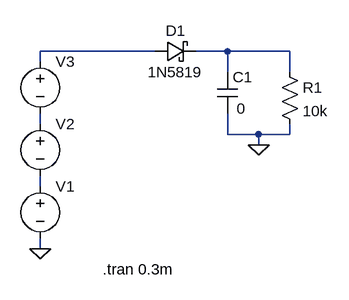
[diagram p0: schematic Detector_1N5819.asc]
Detector_1N5819.asc, the LTspice schematic file:
Version 4
SHEET 1 880 680
WIRE 192 32 16 32
WIRE 304 32 256 32
WIRE 400 32 304 32
WIRE 16 48 16 32
WIRE 304 64 304 32
WIRE 400 64 400 32
WIRE 16 144 16 128
WIRE 304 160 304 128
WIRE 352 160 304 160
WIRE 400 160 400 144
WIRE 400 160 352 160
WIRE 352 176 352 160
WIRE 16 240 16 224
WIRE 16 336 16 320
FLAG 352 176 0
FLAG 16 336 0
SYMBOL schottky 192 48 R270
WINDOW 0 32 32 VTop 2
WINDOW 3 0 32 VBottom 2
SYMATTR InstName D1
SYMATTR Value 1N5819
SYMATTR Description Diode
SYMATTR Type diode
SYMBOL res 384 48 R0
SYMATTR InstName R1
SYMATTR Value 10k
SYMBOL voltage 16 224 R0
WINDOW 3 24 96 Invisible 2
WINDOW 123 0 0 Left 0
SYMATTR Value SINE(0 10 750k 0 0 0 0)
SYMATTR InstName V1
SYMATTR SpiceLine Rser=0
SYMBOL voltage 16 128 R0
WINDOW 3 24 96 Invisible 2
WINDOW 123 0 0 Left 0
SYMATTR Value SINE(0 2.5 740k 0 0 0 0)
SYMATTR InstName V2
SYMATTR SpiceLine Rser=0
SYMBOL voltage 16 32 R0
WINDOW 3 24 96 Invisible 2
WINDOW 123 0 0 Left 0
SYMATTR Value SINE(0 2.5 760k 0 0 0 0)
SYMATTR InstName V3
SYMATTR SpiceLine Rser=0
SYMBOL cap 288 64 R0
WINDOW 3 30 56 Left 2
SYMATTR Value 0
SYMATTR InstName C1
TEXT 112 368 Left 2 !.tran 0.3m

The netlist it stands for:
* Detector_1N5819.asc
D1 N001 N002 1N5819
R1 N002 0 10k
V1 N004 0 SINE(0 10 750k 0 0 0 0) Rser=0
V2 N003 N004 SINE(0 2.5 740k 0 0 0 0) Rser=0
V3 N001 N003 SINE(0 2.5 760k 0 0 0 0) Rser=0
C1 N002 0 0
.model D D
.lib standard.dio
.tran 0.3m
.backanno
.end